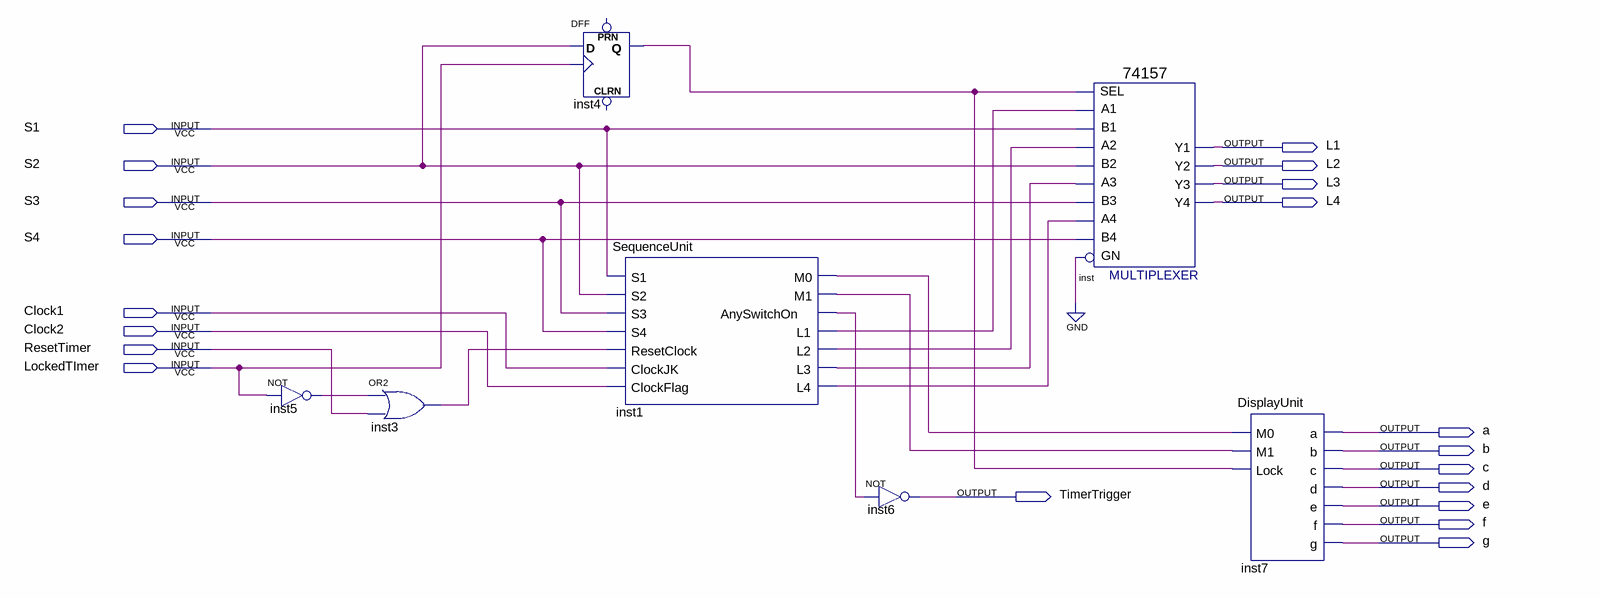
[diagram p0: schematic sheet]
// Quartus schematic FSMLogicLabProject.bdf as structural Verilog: 7 symbols, 20 pins
module FSMLogicLabProject (
  input  S1,
  input  S2,
  input  S3,
  input  S4,
  input  Clock1,
  input  Clock2,
  input  ResetTimer,
  input  LockedTImer,
  output L1,
  output L2,
  output L3,
  output L4,
  output a,
  output b,
  output c,
  output d,
  output TimerTrigger,
  output e,
  output f,
  output g
);

  wire inst1_anyswitchon, inst1_l1, inst1_l2, inst1_l3, inst1_l4, inst1_m0, inst1_m1, inst3_out, inst4_q,
       inst5_out;

  not inst5 (inst5_out, LockedTImer);
  or inst3 (inst3_out, inst5_out, ResetTimer);
  DFF inst4 (.CLK(LockedTImer), .D(S2), .Q(inst4_q));  // open: CLRN, PRN
  SequenceUnit inst1 (
    .S1(S1), .S2(S2), .S3(S3), .S4(S4), .ResetClock(inst3_out), .ClockJK(Clock1), .ClockFlag(Clock2),
    .M0(inst1_m0), .M1(inst1_m1), .AnySwitchOn(inst1_anyswitchon), .L1(inst1_l1), .L2(inst1_l2),
    .L3(inst1_l3), .L4(inst1_l4));
  not inst6 (TimerTrigger, inst1_anyswitchon);
  \74157  inst (
    .A1(inst1_l1), .B1(S1), .SEL(inst4_q), .B2(S2), .A3(inst1_l3), .B3(S3), .A2(inst1_l2), .B4(S4),
    .GN(1'b0), .A4(inst1_l4), .Y2(L2), .Y1(L1), .Y4(L4), .Y3(L3));
  DisplayUnit inst7 (.M0(inst1_m0), .M1(inst1_m1), .Lock(inst4_q), .a(a), .b(b), .c(c), .d(d), .e(e), .f(f), .g(g));
endmodule
